# Altium schematic sheet Herraduras.SchDoc
size A4; Organization: Altium Limited; Address1: L3, 12a Rodborough Rd; Address2: Frenchs Forest; Address3: NSW; Address4: Australia 2086; SheetNumber: 2; SheetTotal: 3
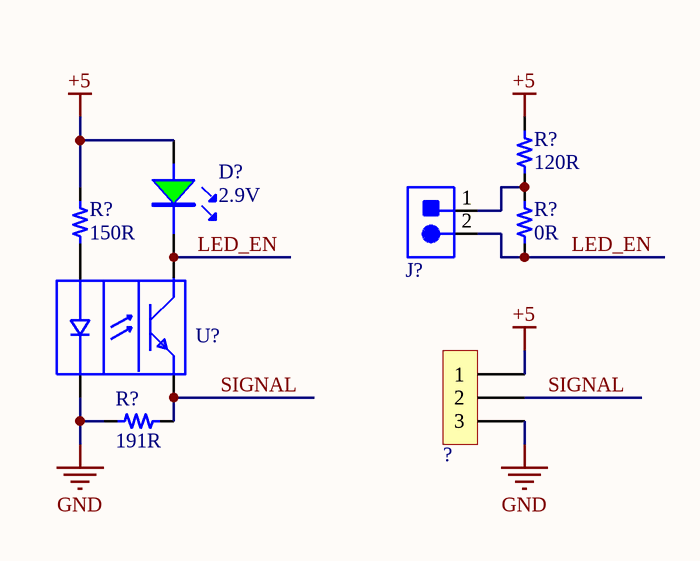
[diagram p0: Herraduras.SchDoc]

## Parts
(Parts that share a designator on the sheet are numbered #1, #2 ... from top to bottom, then left to right.)
?  3x1  [H_3X1_TH_100mil]  (value not drawn)  (no BOM)
D?  2.9V  [0805_LED]
J?  CONN HEADER VERT 2POS 2.54MM  [0022284023]  (value not drawn)
R?#1  value 120R  [0603_res]  (hidden comment: 120R 1/10W)
R?#2  value 150R  [0603_res]  (hidden comment: 150R 1/10W)
R?#3  value 0R  [0603_res]  (hidden comment: 0R 1/10W)
R?#4  value 191R  [0603_res]  (hidden comment: 191R 1/10W)
U?  SENSOR OPT SLOT PHOTOTRAN PCB MT  [RES_0402]  (value not drawn)

## Nets
+5: ?.1 D?.1(A) R?#1.2 R?#2.2
GND: ?.3 R?#4.1 U?.1(CATHODE)
LED_EN: D?.2 J?.2 R?#3.1 U?.3(COLLECTOR)
SIGNAL: ?.2 R?#4.2 U?.4(EMISOR)
NetJ?_1: J?.1 R?#1.1 R?#3.2
NetR?#2_1: R?#2.1 U?.2(ANODE)

## Notes on the sheet
- Title
- Size:
- Date:
- A4
- Number:
- Time:
- Revision:
- Sheet
- of
- File:

## Library data of the parts
? = H_Male_3x1_TH_100mil: ComponentLink1Description: LCSC
D? = LED_0805_Green: LED GREEN CLEAR 0805 SMD; Manufacturer: XINGLIGHT; Manufacturer Part Number: XL-2012UGC; Supplier 1: LCSC; Supplier Part Number 1: C965815; ComponentLink1Description: LCSC; ComponentLink1URL: https://www.lcsc.com/product-detail/Light-Emitting-Diodes-LED_XINGLIGHT-XL-2012UGC_C965815.html
J? = Connector Header Through Hole 2: Connector Header Through Hole 2 position 0.100" (2.54mm); Manufacturer: Molex; Supplier 1: Digi-key; Supplier Part Number 1: WM50016-02-ND; Manufacturer Part Number: 0022284023; ComponentLink1Description: Digi-key; ComponentLink1URL: https://www.digikey.com/en/products/detail/molex/0022284023/313892?s=N4IgTCBcDa5mAOALABjAZhAXQL5A; ComponentLink2Description: Mouser; ComponentLink2URL: https://www.mouser.com/ProductDetail/Molex/22-28-4023?qs=MuwpYaHj750gid5X5P2KgQ%3D%3D
R?#1 = Res_120R_0603_1/10W: 100mW Thick Film Resistor 75V ±100ppm/℃ ±1% 120Ω 0603 Chip Resistor - Surface Mount ROHS; Manufacturer: FOJAN; Manufacturer Part Number: FRC0603F1200TS; ComponentLink1URL: https://lcsc.com/product-detail/Chip-Resistor-Surface-Mount_FOJAN-FRC0603F1200TS_C2906988.html; Supplier 1: LCSC; Supplier Part Number 1: C2906988; ComponentLink1Description: LCSC
R?#2 = Res_150R_0603_1/10W: 100mW Thick Film Resistor 75V ±100ppm/℃ ±1% 150Ω 0603 Chip Resistor - Surface Mount ROHS; Manufacturer: RALEC; Manufacturer Part Number: RTT031500FTP; ComponentLink1URL: https://lcsc.com/product-detail/Chip-Resistor-Surface-Mount_RALEC-RTT031500FTP_C103302.html; Supplier 1: LCSC; Supplier Part Number 1: C103302; ComponentLink1Description: LCSC
R?#3 = Res_0R_0603_1/10W: RES SMD 0R OHM 5% 1/10W 0603; Manufacturer: FOJAN; Manufacturer Part Number: FRC0603P000 TS; ComponentLink1URL: https://www.lcsc.com/product-detail/Chip-Resistor-Surface-Mount_FOJAN-FRC0603P000-TS_C2907080.html; Supplier 1: LCSC; Supplier Part Number 1: C2907080; ComponentLink1Description: LCSC
R?#4 = Res_191R_0603_1/10W: 100mW Thick Film Resistor 75V ±100ppm/℃ ±1% 191Ω 0603 Chip Resistor - Surface Mount ROHS; Manufacturer: FOJAN; Manufacturer Part Number: FRC0603F1910TS; ComponentLink1URL: https://lcsc.com/product-detail/Chip-Resistor-Surface-Mount_FOJAN-FRC0603F1910TS_C3000718.html; Supplier 1: LCSC; Supplier Part Number 1: C3000718; ComponentLink1Description: LCSC
U? = RPI-579N1E: Optical Sensor Through-Beam 0.197" (5mm) Phototransistor PCB Mount; Manufacturer: Rohm Semiconductor; Supplier 1: Digi-key; Supplier Part Number 1: 846-1022-ND; Manufacturer Part Number: RPI-579N1E; ComponentLink1Description: Digi-key; ComponentLink1URL: https://www.digikey.com/en/products/detail/rohm-semiconductor/RPI-579N1E/2408205?s=N4IgTCBcDaIEoAUCSBaArAdgJwDkCMAoiALoC%2BQA; ComponentLink2Description: Mouser; ComponentLink2URL: https://co.mouser.com/ProductDetail/ROHM-Semiconductor/RPI-579N1E?qs=U%2FDGNQcZ28oAsNHreilnOw%3D%3D